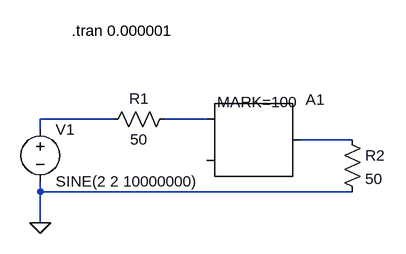
[diagram p0: schematic FMmod.asc]
FMmod.asc, the LTspice schematic file:
Version 4
SHEET 1 880 680
WIRE 192 208 80 208
WIRE 336 208 272 208
WIRE 80 224 80 208
WIRE 560 240 480 240
WIRE 80 320 80 304
WIRE 560 320 80 320
WIRE 80 368 80 320
FLAG 80 368 0
SYMBOL SpecialFunctions/modulate 336 208 R0
WINDOW 3 16 -26 Left 2
SYMATTR InstName A1
SYMATTR Value MARK=100
SYMATTR Value2 SPACE=2
SYMBOL voltage 80 208 R0
SYMATTR InstName V1
SYMATTR Value SINE(2 2 10000000)
SYMBOL res 288 192 R90
WINDOW 0 0 56 VBottom 2
WINDOW 3 32 56 VTop 2
SYMATTR InstName R1
SYMATTR Value 50
SYMBOL res 544 224 R0
SYMATTR InstName R2
SYMATTR Value 50
TEXT 128 72 Left 2 !.tran 0.000001

The netlist it stands for:
* FMmod.asc
A1 N002 0 0 0 0 0 N003 0 MODULATOR MARK=100 SPACE=2
V1 N001 0 SINE(2 2 10000000)
R1 N002 N001 50
R2 N003 0 50
.tran 0.000001
.backanno
.end